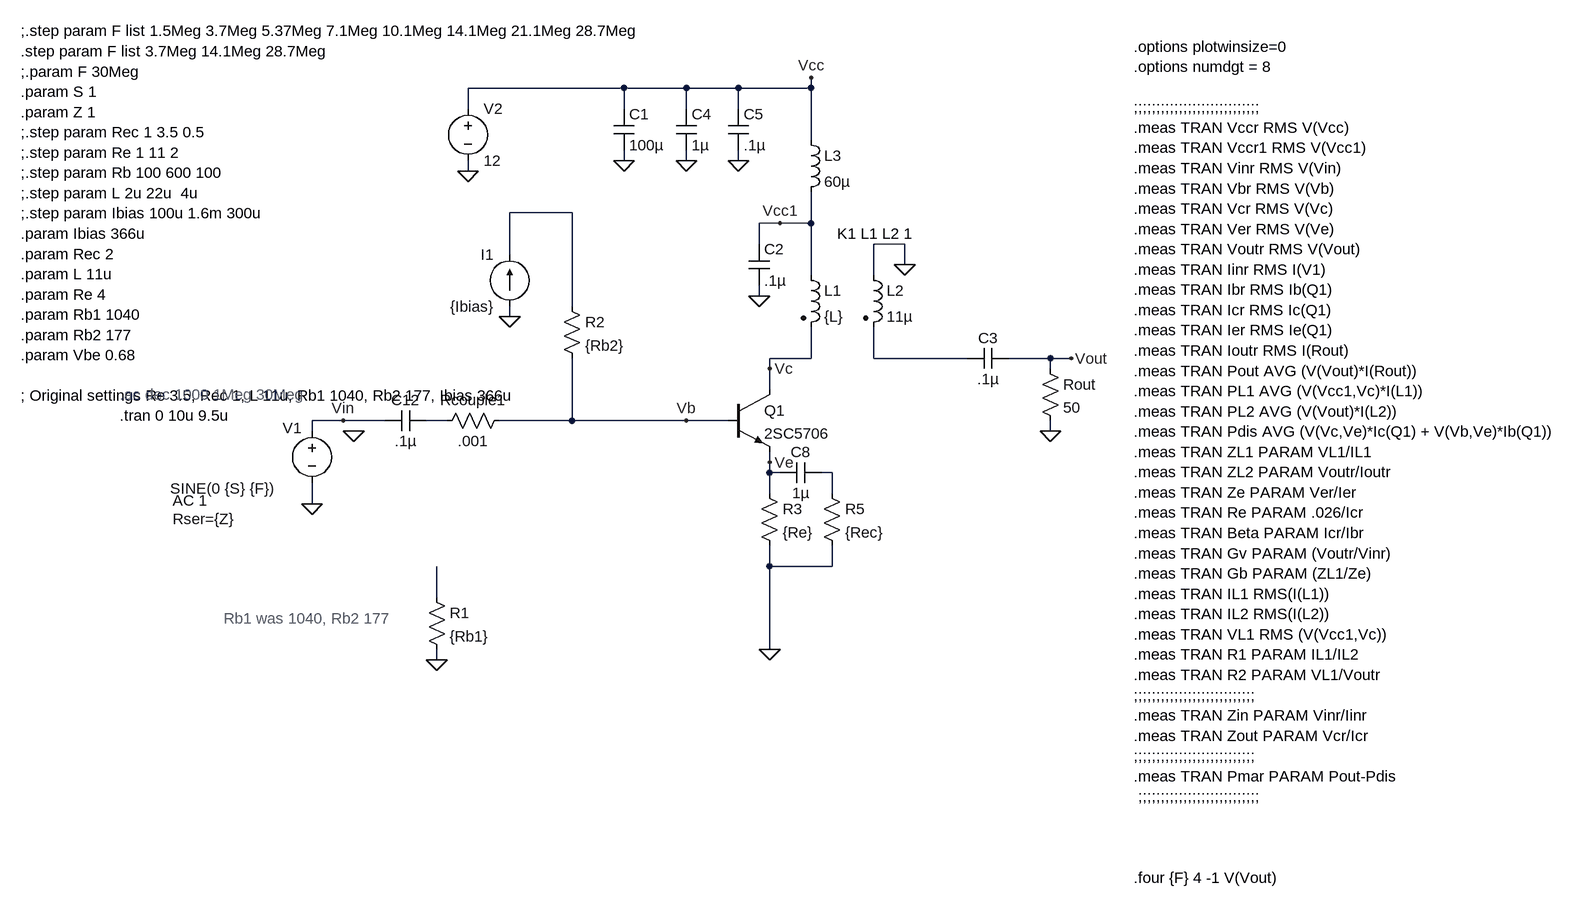
[diagram p0: schematic 2sc5706 Bias.asc]
2sc5706 Bias.asc, the LTspice schematic file:
Version 4
SHEET 1 2500 1496
WIRE 192 -320 -48 -320
WIRE 288 -320 192 -320
WIRE 368 -320 288 -320
WIRE 480 -320 480 -336
WIRE 480 -320 368 -320
WIRE -48 -288 -48 -320
WIRE 192 -288 192 -320
WIRE 288 -288 288 -320
WIRE 368 -288 368 -320
WIRE 480 -240 480 -320
WIRE 192 -208 192 -224
WIRE 288 -208 288 -224
WIRE 368 -208 368 -224
WIRE -48 -192 -48 -208
WIRE 112 -128 16 -128
WIRE 432 -112 400 -112
WIRE 480 -112 480 -160
WIRE 480 -112 432 -112
WIRE 400 -80 400 -112
WIRE 624 -80 576 -80
WIRE 16 -64 16 -128
WIRE 624 -48 624 -80
WIRE 480 -32 480 -112
WIRE 576 -32 576 -80
WIRE 400 0 400 -16
WIRE 112 16 112 -128
WIRE 16 32 16 16
WIRE 480 96 480 48
WIRE 480 96 416 96
WIRE 576 96 576 48
WIRE 720 96 576 96
WIRE 848 96 784 96
WIRE 880 96 848 96
WIRE 416 112 416 96
WIRE 848 112 848 96
WIRE 416 144 416 112
WIRE -240 192 -288 192
WIRE -176 192 -240 192
WIRE -80 192 -112 192
WIRE 112 192 112 96
WIRE 112 192 0 192
WIRE 288 192 112 192
WIRE 352 192 288 192
WIRE -288 208 -288 192
WIRE 848 208 848 192
WIRE 416 256 416 240
WIRE 416 272 416 256
WIRE 432 272 416 272
WIRE 512 272 496 272
WIRE 416 304 416 272
WIRE 512 304 512 272
WIRE -288 320 -288 288
WIRE 416 416 416 384
WIRE 512 416 512 384
WIRE 512 416 416 416
WIRE -96 464 -96 416
WIRE 416 544 416 416
WIRE -96 560 -96 544
FLAG 192 -208 0
FLAG -288 320 0
FLAG 416 544 0
FLAG 880 96 Vout
FLAG 848 208 0
FLAG 288 -208 0
FLAG 368 -208 0
FLAG 288 192 Vb
FLAG 416 256 Ve
FLAG -240 192 Vin
FLAG 416 112 Vc
FLAG -96 560 0
FLAG 624 -48 0
FLAG -48 -192 0
FLAG 400 0 0
FLAG 480 -336 Vcc
FLAG 432 -112 Vcc1
FLAG 16 32 0
FLAG -224 208 0
SYMBOL npn 352 144 R0
SYMATTR InstName Q1
SYMATTR Value 2SC5706
SYMBOL voltage -288 192 R0
WINDOW 0 -45 11 Left 2
WINDOW 3 -218 104 Left 2
WINDOW 123 -214 123 Left 2
WINDOW 39 -214 151 Left 2
SYMATTR InstName V1
SYMATTR Value SINE(0 {S} {F})
SYMATTR Value2 AC 1
SYMATTR SpiceLine Rser={Z}
SYMBOL res -112 448 R0
SYMATTR InstName R1
SYMATTR Value {Rb1}
SYMBOL cap 176 -288 R0
SYMATTR InstName C1
SYMATTR Value 100µ
SYMBOL cap 784 80 R90
WINDOW 0 0 32 VBottom 2
WINDOW 3 32 32 VTop 2
SYMATTR InstName C3
SYMATTR Value .1µ
SYMBOL ind2 464 -48 R0
SYMATTR InstName L1
SYMATTR Value {L}
SYMATTR Type ind
SYMBOL res 832 96 R0
SYMATTR InstName Rout
SYMATTR Value 50
SYMBOL cap 272 -288 R0
SYMATTR InstName C4
SYMATTR Value 1µ
SYMBOL cap 352 -288 R0
SYMATTR InstName C5
SYMATTR Value .1µ
SYMBOL ind2 560 -48 R0
SYMATTR InstName L2
SYMATTR Value 11µ
SYMATTR Type ind
SYMBOL res 400 288 R0
SYMATTR InstName R3
SYMATTR Value {Re}
SYMBOL res 96 0 R0
SYMATTR InstName R2
SYMATTR Value {Rb2}
SYMBOL cap 496 256 R90
WINDOW 0 0 32 VBottom 2
WINDOW 3 32 32 VTop 2
SYMATTR InstName C8
SYMATTR Value 1µ
SYMBOL res 16 176 R90
WINDOW 0 0 56 VBottom 2
WINDOW 3 32 56 VTop 2
SYMATTR InstName Rcouple1
SYMATTR Value .001
SYMBOL cap -112 176 R90
WINDOW 0 0 32 VBottom 2
WINDOW 3 32 32 VTop 2
SYMATTR InstName C12
SYMATTR Value .1µ
SYMBOL voltage -48 -304 R0
WINDOW 123 0 0 Left 0
WINDOW 39 0 0 Left 0
SYMATTR InstName V2
SYMATTR Value 12
SYMBOL ind 464 -256 R0
SYMATTR InstName L3
SYMATTR Value 60µ
SYMBOL cap 384 -80 R0
SYMATTR InstName C2
SYMATTR Value .1µ
SYMBOL res 496 288 R0
SYMATTR InstName R5
SYMATTR Value {Rec}
SYMBOL current 16 16 R180
WINDOW 0 24 80 Left 2
WINDOW 3 24 0 Left 2
WINDOW 123 0 0 Left 0
WINDOW 39 0 0 Left 0
SYMATTR InstName I1
SYMATTR Value {Ibias}
TEXT -584 184 Left 2 !.tran 0 10u 9.5u
TEXT 976 -384 Left 2 !.options plotwinsize=0\n.options numdgt = 8\n \n;;;;;;;;;;;;;;;;;;;;;;;;;;;;\n.meas TRAN Vccr RMS V(Vcc)\n.meas TRAN Vccr1 RMS V(Vcc1)\n.meas TRAN Vinr RMS V(Vin)\n.meas TRAN Vbr RMS V(Vb)\n.meas TRAN Vcr RMS V(Vc)\n.meas TRAN Ver RMS V(Ve)\n.meas TRAN Voutr RMS V(Vout)\n.meas TRAN Iinr RMS I(V1)\n.meas TRAN Ibr RMS Ib(Q1)\n.meas TRAN Icr RMS Ic(Q1)\n.meas TRAN Ier RMS Ie(Q1)\n.meas TRAN Ioutr RMS I(Rout)\n.meas TRAN Pout AVG (V(Vout)*I(Rout))\n.meas TRAN PL1 AVG (V(Vcc1,Vc)*I(L1))\n.meas TRAN PL2 AVG (V(Vout)*I(L2))\n.meas TRAN Pdis AVG (V(Vc,Ve)*Ic(Q1) + V(Vb,Ve)*Ib(Q1))\n.meas TRAN ZL1 PARAM VL1/IL1\n.meas TRAN ZL2 PARAM Voutr/Ioutr\n.meas TRAN Ze PARAM Ver/Ier\n.meas TRAN Re PARAM .026/Icr\n.meas TRAN Beta PARAM Icr/Ibr\n.meas TRAN Gv PARAM (Voutr/Vinr)\n.meas TRAN Gb PARAM (ZL1/Ze)\n.meas TRAN IL1 RMS(I(L1))\n.meas TRAN IL2 RMS(I(L2))\n.meas TRAN VL1 RMS (V(Vcc1,Vc))\n.meas TRAN R1 PARAM IL1/IL2\n.meas TRAN R2 PARAM VL1/Voutr\n;;;;;;;;;;;;;;;;;;;;;;;;;;;\n.meas TRAN Zin PARAM Vinr/Iinr\n.meas TRAN Zout PARAM Vcr/Icr\n;;;;;;;;;;;;;;;;;;;;;;;;;;;\n.meas TRAN Pmar PARAM Pout-Pdis\n ;;;;;;;;;;;;;;;;;;;;;;;;;;;\n \n \n \n.four {F} 4 -1 V(Vout)
TEXT -736 -408 Left 2 !;.step param F list 1.5Meg 3.7Meg 5.37Meg 7.1Meg 10.1Meg 14.1Meg 21.1Meg 28.7Meg\n.step param F list 3.7Meg 14.1Meg 28.7Meg\n;.param F 30Meg\n.param S 1\n.param Z 1\n;.step param Rec 1 3.5 0.5\n;.step param Re 1 11 2\n;.step param Rb 100 600 100\n;.step param L 2u 22u  4u\n;.step param Ibias 100u 1.6m 300u\n.param Ibias 366u\n.param Rec 2 \n.param L 11u\n.param Re 4\n.param Rb1 1040 \n.param Rb2 177 \n.param Vbe 0.68\n \n; Original settings Re 3.5, Rec 1, L 11u, Rb1 1040, Rb2 177, Ibias 366u
TEXT 520 -96 Left 2 !K1 L1 L2 1
TEXT -584 152 Left 2 ;.ac dec 1000 1Meg 30Meg
TEXT -424 496 Left 2 ;Rb1 was 1040, Rb2 177

The netlist it stands for:
* 2sc5706 Bias.asc
Q1 Vc Vb Ve 0 2SC5706
V1 Vin 0 SINE(0 {S} {F}) AC 1 Rser={Z}
R1 N005 0 {Rb1}
C1 Vcc 0 100µ
C3 Vout N002 .1µ
L1 Vcc1 Vc {L}
Rout Vout 0 50
C4 Vcc 0 1µ
C5 Vcc 0 .1µ
L2 0 N002 11µ
R3 Ve 0 {Re}
R2 N001 Vb {Rb2}
C8 N004 Ve 1µ
Rcouple1 Vb N003 .001
C12 N003 Vin .1µ
V2 Vcc 0 12
L3 Vcc Vcc1 60µ
C2 Vcc1 0 .1µ
R5 N004 0 {Rec}
I1 0 N001 {Ibias}
.model NPN NPN
.model PNP PNP
.lib standard.bjt
.tran 0 10u 9.5u
.options plotwinsize=0
.options numdgt = 8
;;;;;;;;;;;;;;;;;;;;;;;;;;;;
.meas TRAN Vccr RMS V(Vcc)
.meas TRAN Vccr1 RMS V(Vcc1)
.meas TRAN Vinr RMS V(Vin)
.meas TRAN Vbr RMS V(Vb)
.meas TRAN Vcr RMS V(Vc)
.meas TRAN Ver RMS V(Ve)
.meas TRAN Voutr RMS V(Vout)
.meas TRAN Iinr RMS I(V1)
.meas TRAN Ibr RMS Ib(Q1)
.meas TRAN Icr RMS Ic(Q1)
.meas TRAN Ier RMS Ie(Q1)
.meas TRAN Ioutr RMS I(Rout)
.meas TRAN Pout AVG (V(Vout)*I(Rout))
.meas TRAN PL1 AVG (V(Vcc1,Vc)*I(L1))
.meas TRAN PL2 AVG (V(Vout)*I(L2))
.meas TRAN Pdis AVG (V(Vc,Ve)*Ic(Q1) + V(Vb,Ve)*Ib(Q1))
.meas TRAN ZL1 PARAM VL1/IL1
.meas TRAN ZL2 PARAM Voutr/Ioutr
.meas TRAN Ze PARAM Ver/Ier
.meas TRAN Re PARAM .026/Icr
.meas TRAN Beta PARAM Icr/Ibr
.meas TRAN Gv PARAM (Voutr/Vinr)
.meas TRAN Gb PARAM (ZL1/Ze)
.meas TRAN IL1 RMS(I(L1))
.meas TRAN IL2 RMS(I(L2))
.meas TRAN VL1 RMS (V(Vcc1,Vc))
.meas TRAN R1 PARAM IL1/IL2
.meas TRAN R2 PARAM VL1/Voutr
;;;;;;;;;;;;;;;;;;;;;;;;;;;
.meas TRAN Zin PARAM Vinr/Iinr
.meas TRAN Zout PARAM Vcr/Icr
;;;;;;;;;;;;;;;;;;;;;;;;;;;
.meas TRAN Pmar PARAM Pout-Pdis
 ;;;;;;;;;;;;;;;;;;;;;;;;;;;
.four {F} 4 -1 V(Vout)
;.step param F list 1.5Meg 3.7Meg 5.37Meg 7.1Meg 10.1Meg 14.1Meg 21.1Meg 28.7Meg
.step param F list 3.7Meg 14.1Meg 28.7Meg
;.param F 30Meg
.param S 1
.param Z 1
;.step param Rec 1 3.5 0.5
;.step param Re 1 11 2
;.step param Rb 100 600 100
;.step param L 2u 22u  4u
;.step param Ibias 100u 1.6m 300u
.param Ibias 366u
.param Rec 2
.param L 11u
.param Re 4
.param Rb1 1040
.param Rb2 177
.param Vbe 0.68
; Original settings Re 3.5, Rec 1, L 11u, Rb1 1040, Rb2 177, Ibias 366u
K1 L1 L2 1
* .ac dec 1000 1Meg 30Meg
* Rb1 was 1040, Rb2 177
.backanno
.end